# Altium project UZ_D_Incr_Encoder.PrjPCB
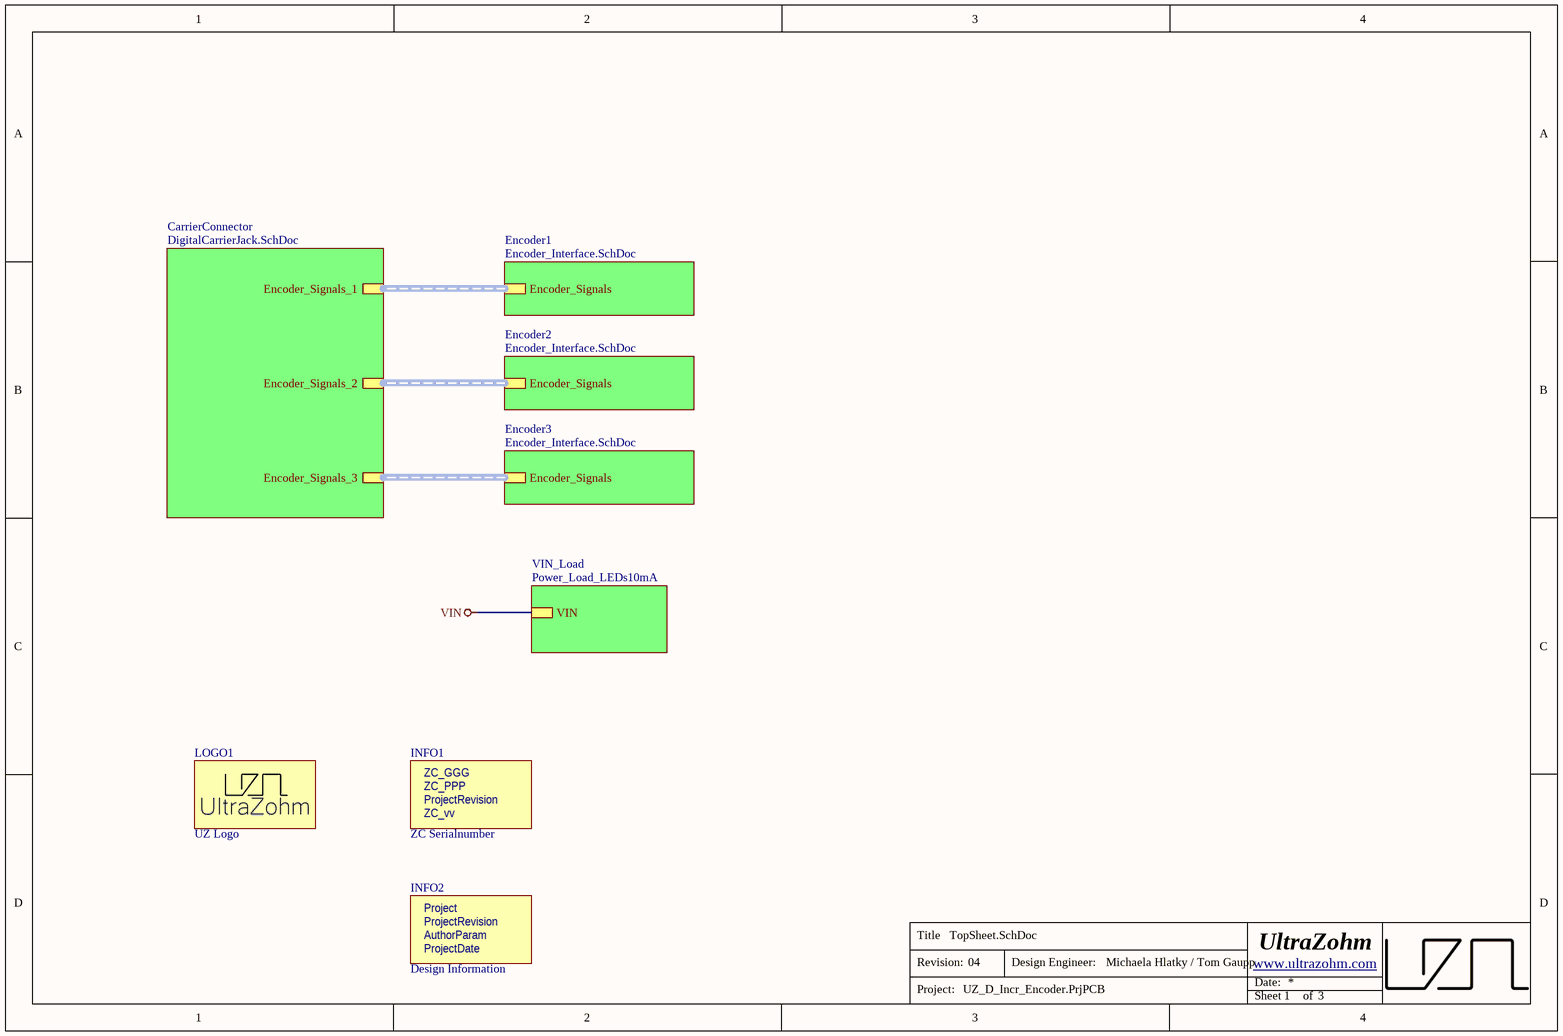
[diagram p0: TopSheet.SchDoc]
Author: Michaela Hlatky / Tom Gaupp; AuthorParam: Michaela Hlatky / Tom Gaupp; Date: 06/2022; Project: uz_d_incr_encoder; ProjectDate: 06/26; ProjectNameCustom: UZ_D_Incr_Encoder; ProjectRevision: 04; ZC_GGG: 000; ZC_PPP: 006; ZC_vv: 00
3 sheets, 101 parts. Net scope: hierarchical (ports join the sheet entries above them; power ports are global).
Board file: UZ_D_Incr_Encoder.PcbDoc
Sheets:
  TopSheet.SchDoc
    Encoder2 = Encoder_Interface.SchDoc
    Encoder3 = Encoder_Interface.SchDoc
    Encoder1 = Encoder_Interface.SchDoc
    CarrierConnector = DigitalCarrierJack.SchDoc

## Sheet TopSheet.SchDoc
size A4; Author: Michaela Hlatky / Tom Gaupp; CompanyName: Technische Hochschule Nürnberg Georg Simon Ohm; Organization: UltraZohm; Address1: Kesslerplatz 12; Address2: 90489 Nürnberg; Address3: GERMANY; DocumentNumber: 1; SheetNumber: 1; SheetTotal: 3; Website: www.ultrazohm.com

### Parts
INFO1  ZC Serialnumber  [ZC-Serial]  (no BOM)
INFO2  Design Information  [Design_info]  (no BOM)
LOGO1  UZ Logo  [UZ_Logo_small]  (no BOM)

### Sub-sheets
CarrierConnector = DigitalCarrierJack.SchDoc: Encoder_Signals_2 (harness Encoder_Signals), Encoder_Signals_1 (harness Encoder_Signals), Encoder_Signals_3 (harness Encoder_Signals)
Encoder1 = Encoder_Interface.SchDoc: Encoder_Signals (harness Encoder_Signals)
Encoder2 = Encoder_Interface.SchDoc: Encoder_Signals (harness Encoder_Signals)
Encoder3 = Encoder_Interface.SchDoc: Encoder_Signals (harness Encoder_Signals)
VIN_Load = Power_Load_LEDs10mA (file not in this document): VIN

### Buses and harness runs
harness sheet CarrierConnector/Encoder_Signals_1 = sheet Encoder1/Encoder_Signals
harness sheet CarrierConnector/Encoder_Signals_2 = sheet Encoder2/Encoder_Signals
harness sheet CarrierConnector/Encoder_Signals_3 = sheet Encoder3/Encoder_Signals

### Notes on the sheet
- Title
- Revision:
- Design Engineer:
- Date:
- Project:
- Sheet
- of
- (in symbol Design Information) Project; ProjectRevision; AuthorParam; ProjectDate
- (in symbol ZC-Serial) ZC_GGG; ZC_PPP; ProjectRevision; ZC_vv

### Library data of the parts
INFO1 = ZC-Serial: Manufacturer: UltraZohm; Value: GGG-PPP-VVvv; Created from: FRosner; Manufacturer Part Number: ZC-Serial; PartID: 58; Created On: 15/04/2025 09:17:14; ComponentLink1Description: https://docs.ultrazohm.com/; ComponentLink1URL: homepage; Component Type: ZC Serialnumber; Last Updated: 15/04/2025 09:17:14; Supplier 1: -; Supplier Part Number 1: -; Type: Serial Number; Live Cycle Status: 1
INFO2 = Design Information: Manufacturer: UltraZohm; Created from: MGremer; Manufacturer Part Number: Design Information; PartID: 12; Created On: 03/11/2021 09:04:23; ComponentLink1Description: https://docs.ultrazohm.com/; ComponentLink1URL: homepage; Component Type: Design Information; Last Updated: 15/04/2025 09:29:36; Supplier 1: -; Supplier Part Number 1: -; Type: Design Information; Value: Design Information; Live Cycle Status: 1
LOGO1 = Logo small: Manufacturer: UltraZohm; Created from: MGremer; Created: Jan2021_Liegmann; Value: Logo; Manufacturer Part Number: Logo small; PartID: 10; Created On: 03.11.2021 09:04:23; ComponentLink1Description: https://docs.ultrazohm.com/; ComponentLink1URL: homepage; Component Type: Logo; Last Updated: 03.11.2021 09:05:50; Supplier 1: -; Supplier Part Number 1: -; Type: Logo; Live Cycle Status: 1

## Sheet Encoder_Interface.SchDoc
size A4; Author: Michaela Hlatky / Tom Gaupp; CompanyName: Technische Hochschule Nürnberg Georg Simon Ohm; Organization: UltraZohm; Address1: Kesslerplatz 12; Address2: 90489 Nürnberg; Address3: GERMANY; DocumentNumber: 3; SheetNumber: 3; SheetTotal: 3; Website: www.ultrazohm.com
Used 3 times, as channels Encoder2, Encoder3, Encoder1. Parts and nets are listed once, with the designators drawn on the sheet.
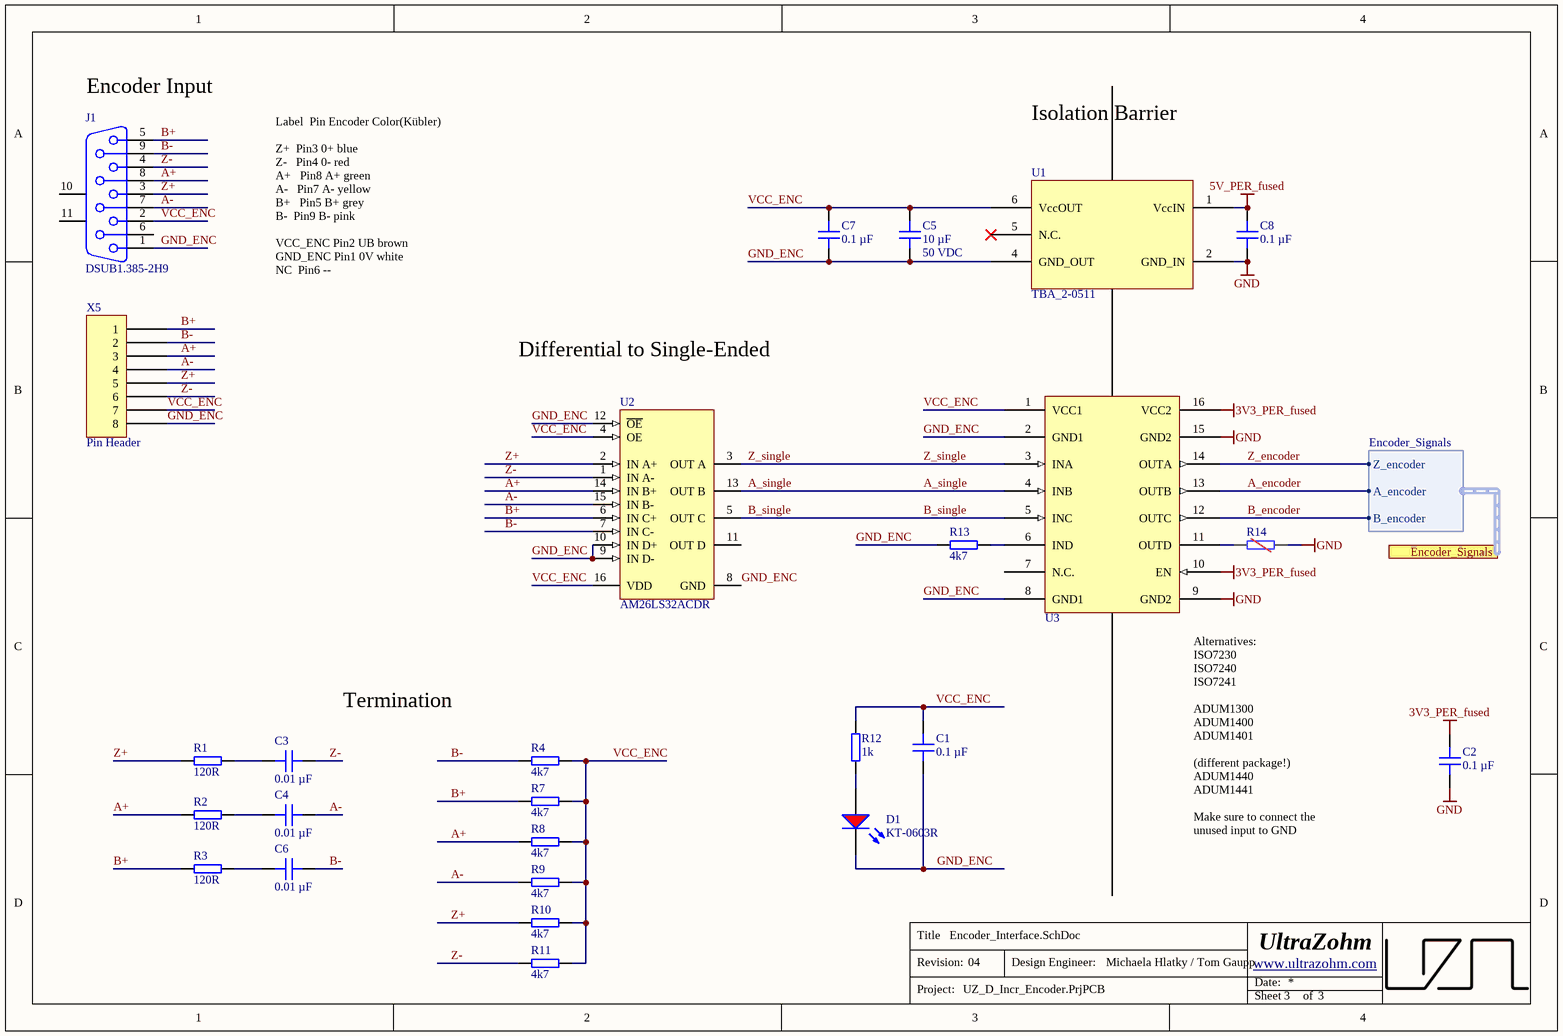
[diagram p1: Encoder_Interface.SchDoc]

### Parts
C1  0.1 µF  [C_0805]
C2  0.1 µF  [C_0805]
C3  0.01 µF  [C_0805]
C4  0.01 µF  [C_0805]
C5  10 µF  Voltage Rating: 50 VDC  [C_1206]
C6  0.01 µF  [C_0805]
C7  0.1 µF  [C_0805]
C8  0.1 µF  [C_0805]
D1  KT-0603R  [WL-SMCW_0603]
J1  DSUB1.385-2H9  [DSUB1.385-2H9]
R1  120R  [RES 0603_1608]
R2  120R  [RES 0603_1608]
R3  120R  [RES 0603_1608]
R4  4k7  [RES 0603_1608]
R7  4k7  [RES 0603_1608]
R8  4k7  [RES 0603_1608]
R9  4k7  [RES 0603_1608]
R10  4k7  [RES 0603_1608]
R11  4k7  [RES 0603_1608]
R12  1k  [RES 0603_1608]
R13  4k7  [RES 0603_1608]
R14  DNP  [R_0603_TE-DNP]  (value not drawn)  (no BOM)
U1  TBA_2-0511  [SIP7]
U2  AM26LS32ACDR  [D0016A_M]
U3  ISO7240MDWR  [SOIC-16]  (value not drawn)
X5  Pin Header  [HDR1X8]

### Ports
Encoder_Signals (harness Encoder_Signals)

### Harnesses
Encoder_Signals: A_encoder, B_encoder, Z_encoder

### Nets
3V3_PER_fused: C2.2 U3.10(EN) U3.16(VCC2)
5V_PER_fused: C8.2 U1.1(VccIN)
GND: C2.1 C8.1 R14.2 U1.2(GND_IN) U3.9(GND2) U3.15(GND2)
A+: J1.8 R2.1 R8.1 U2.14(IN_B+) X5.3
A-: C4.2 J1.7 R9.1 U2.15(IN_B-) X5.4
A_encoder: U3.13(OUTB) ; port Encoder_Signals.A_encoder
A_single: U2.13(OUT_B) U3.4(INB)
B+: J1.5 R3.1 R7.1 U2.6(IN_C+) X5.1
B-: C6.2 J1.9 R4.1 U2.7(IN_C-) X5.2
B_encoder: U3.12(OUTC) ; port Encoder_Signals.B_encoder
B_single: U2.5(OUT_C) U3.5(INC)
GND_ENC: C1.1 C5.1 C7.1 D1.1(K) J1.1 R13.1 U1.4(GND_OUT) U2.8(GND) U2.9(IN_D-) U2.10(IN_D+) U2.12(~{OE}) U3.2(GND1) U3.8(GND1) X5.8
VCC_ENC: C1.2 C5.2 C7.2 J1.2 R4.2 R7.2 R8.2 R9.2 R10.2 R11.2 R12.2 U1.6(VccOUT) U2.4(OE) U2.16(VDD) U3.1(VCC1) X5.7
Z+: J1.3 R1.1 R10.1 U2.2(IN_A+) X5.5
Z-: C3.2 J1.4 R11.1 U2.1(IN_A-) X5.6
Z_encoder: U3.14(OUTA) ; port Encoder_Signals.Z_encoder
Z_single: U2.3(OUT_A) U3.3(INA)
NetC3_1: C3.1 R1.2
NetC4_1: C4.1 R2.2
NetC6_1: C6.1 R3.2
NetD1_2: D1.2(A) R12.1
NetR13_2: R13.2 U3.6(IND)
NetR14_1: R14.1 U3.11(OUTD)

Not connected (* = marked no-connect by the designer): J1 6 10(MH1) 11(MH2); U1 5(N.C.)*; U2 11(OUT_D); U3 7(N.C.)

### Channels
Encoder2: designators C1=C1_2 C2=C2_2 C3=C3_2 C4=C4_2 C5=C5_2 C6=C6_2 C7=C7_2 C8=C8_2 D1=D1_2 J1=J1_2 R1=R1_2 R2=R2_2 R3=R3_2 R4=R4_2 R7=R7_2 R8=R8_2 R9=R9_2 R10=R10_2 R11=R11_2 R12=R12_2 R13=R13_2 R14=R14_1 U1=U1_1 U2=U2_2 U3=U3_1 X5=X5_2
Encoder3: designators C1=C1_3 C2=C2_3 C3=C3_3 C4=C4_3 C5=C5_3 C6=C6_3 C7=C7_3 C8=C8_3 D1=D1_3 J1=J1_3 R1=R1_3 R2=R2_3 R3=R3_3 R4=R4_3 R7=R7_3 R8=R8_3 R9=R9_3 R10=R10_3 R11=R11_3 R12=R12_3 R13=R13_3 R14=R14_2 U1=U1_2 U2=U2_3 U3=U3_2 X5=X5_3
Encoder1: designators C1=C1_1 C2=C2_1 C3=C3_1 C4=C4_1 C5=C5_1 C6=C6_1 C7=C7_1 C8=C8_1 D1=D1_1 J1=J1_1 R1=R1_1 R2=R2_1 R3=R3_1 R4=R4_1 R7=R7_1 R8=R8_1 R9=R9_1 R10=R10_1 R11=R11_1 R12=R12_1 R13=R13_1 R14=R14_3 U1=U1_3 U2=U2_1 U3=U3_3 X5=X5_1

### Notes on the sheet
- (near J1) Encoder Input
- Isolation Barrier
- Label		Pin	Encoder	Color(Kübler)
  Z+		Pin3	0+	blue
  Z- 		Pin4	0-	red
  A+ 		Pin8	A+	green
  A- 		Pin7	A-	yellow
  B+ 		Pin5	B+	grey
  B-		Pin9	B-	pink
  VCC_ENC	Pin2	UB	brown
  GND_ENC	Pin1	0V	white
  NC		Pin6	--
- Differential to Single-Ended
- Termination
- (near U3) Alternatives:
  ISO7230
  ISO7240
  ISO7241
  ADUM1300
  ADUM1400
  ADUM1401
  (different package!)
  ADUM1440
  ADUM1441
  Make sure to connect the unused input to GND
- Title
- Revision:
- Design Engineer:
- Date:
- Project:
- Sheet
- of

### Library data of the parts
C1 C2 C7 C8 = C0805C104J5RECTU: Capacitor 0805, 50 VDC, 0.1 µF, X7R; Manufacturer: KEMET; Tolerance: 5 %; Voltage Rating: 50 VDC; Created from: MGremer; Manufacturer Part Number: C0805C104J5RECTU; PartID: 17; Created On: 20.12.2020 13:54:13; ComponentLink1Description: Datasheet; ComponentLink1URL: https://www.mouser.de/datasheet/2/212/KEM_C1002_X7R_SMD-1102033.pdf; Component Type: Capacitor 0805; Device Package: 0805; Last Updated: 27.05.2022 20:15:41; Mounting Type: SMD; Operating Temperature: -55 - 125°C; Series: SMD Comm X7R; Supplier 1: Mouser; Supplier Part Number 1: 80-C0805C104J5RECTU; Type: Capacitor; Value: 0.1 µF; Live Cycle Status: 1; Stock number: Labor SMD Container; LCSC Part Number: C49678
C3 C4 C6 = C0805X103K5RAC3316: Capacitor 0805, 50 VDC, 0.01 µF, X7R; Manufacturer: KEMET; Tolerance: 10 %; Voltage Rating: 50 VDC; Created from: MGremer; Manufacturer Part Number: C0805X103K5RAC3316; PartID: 21; Created On: 20.12.2020 13:54:13; ComponentLink1Description: Datasheet; ComponentLink1URL: https://www.mouser.de/datasheet/2/212/KEM_X7R_FT_VW_AUDI-1775098.pdf; Component Type: Capacitor 0805; Device Package: 0805; Last Updated: 27.05.2022 20:11:47; Mounting Type: SMD; Operating Temperature: -55 - 125°C; Series: SMD Comm X7R; Supplier 1: Mouser; Supplier Part Number 1: 80-C0805X103K5RC3316; Type: Capacitor; Value: 0.01 µF; Live Cycle Status: 1; Stock number: Labor SMD Container; LCSC Part Number: C1710
C5 = CGA5L1X7R1H106K160AC: Capacitor 1206, 50 VDC, 10 µF, X7R; Manufacturer: TDK; Tolerance: 10 %; Created from: MGremer; Manufacturer Part Number: CGA5L1X7R1H106K160AC; PartID: 25; Created On: 20.12.2020 13:54:13; ComponentLink1Description: Datasheet; ComponentLink1URL: https://product.tdk.com/info/en/catalog/datasheets/mlcc_automotive_general_en.pdf; Component Type: Capacitor 1206; Device Package: 1206; Last Updated: 27.05.2022 14:15:21; Mounting Type: SMD; Operating Temperature: -55 - 125°C; Series: CGA; Supplier 1: Mouser; Supplier Part Number 1: 810-CGA5L1X7R1H106K1; Type: Capacitor; Value: 10 µF; Live Cycle Status: 1; LCSC Part Number: C13585; Stock number: Labor SMD Container
D1 = KT-0603R: LED RED 520~625NM 90~100MCD@20MA TOP VIEW 0603 ROHS; Manufacturer: Hubei KENTO Elec; Type: Standard; Created from: T. Wendt; Forward Current I_f: 20 mA; Forward Voltage U_f: 2.1 V; Wavelength: 620 nm; Light Intensity: 110 mcd; Nominal Power: 42 mW; Manufacturer Part Number: KT-0603R; PartID: 8; Created On: 03.03.2021 10:06:23; ComponentLink1Description: Datasheet; ComponentLink1URL: https://datasheet.lcsc.com/szlcsc/Hubei-KENTO-Elec-KT-0603R_C2286.pdf; Component Type: LED Diode; Device Package: 0603; Last Updated: 04.03.2021 09:02:49; Mounting Type: SMD; Operating Temperature: -40 - 85 °C; Supplier 1: LCSC; Supplier Part Number 1: C2286; Live Cycle Status: 1; Stock number: not stored; Color: red; LCSC Part Number: C2286
J1 = DSUB1.385-2H9: Connector; D Subminiature; 9 Position; Right Angle; Pitch 1.385 mm; Manufacturer: TE Connectivity; PackageDocument: O; Positions: 9; Gender: Receptacle; Created from: MHlatky; Published: 15-Jun-2001; LatestRevisionDate: 17-Jul-2002; LatestRevisionNote: Re-released for DXP Platform.; DatasheetDocument: 1-Sep-1999; PackageReference: 788750; Publisher: Altium Limited; Orientation: Right Angle; Manufacturer Part Number: DSUB1.385-2H9; PartID: 5; Created On: 26.01.2021 09:19:51; ComponentLink1Description: Datasheet; ComponentLink1URL: https://www.mouser.de/datasheet/2/418/7/ENG_CD_2311765_D-2072985.pdf; Component Type: DSUB Connector; Device Package: -; Last Updated: 27.05.2022 15:54:50; Type: DSUB Connector; Live Cycle Status: 1; Stock number: not stored; Supplier 1: Mouser; Supplier Part Number 1: 571-2311765-1; LCSC Part Number: C141882
R1-R3 = RK73B1JTTD121J: SMD resistor E24 series; Manufacturer: KOA Speer; Tolerance: 5%; Created from: MGremer; Manufacturer Part Number: RK73B1JTTD121J; PartID: 52; Created On: 14.12.2020 16:17:14; ComponentLink1Description: Datasheet; ComponentLink1URL: https://www.mouser.de/datasheet/2/219/RK73B-1825463.pdf; Component Type: SMD resistor; Device Package: 0603; Last Updated: 27.05.2022 13:40:47; Mounting Type: SMD; Supplier 1: Mouser; Supplier Part Number 1: 660-RK73B1JTTD121J; Type: Resistor; Value: 120R; Live Cycle Status: 1; Stock number: Labor SMD Container; LCSC Part Number: C22787
R4 R7-R11 R13 = RK73B1JTTD472J: SMD resistor E24 series; Manufacturer: KOA Speer; Tolerance: 5%; Created from: MGremer; Manufacturer Part Number: RK73B1JTTD472J; PartID: 90; Created On: 14.12.2020 16:17:14; ComponentLink1Description: Datasheet; ComponentLink1URL: https://www.mouser.de/datasheet/2/219/RK73B-1825463.pdf; Component Type: SMD resistor; Device Package: 0603; Last Updated: 27.05.2022 13:46:16; Mounting Type: SMD; Supplier 1: Mouser; Supplier Part Number 1: 660-RK73B1JTTD472J; Type: Resistor; Value: 4k7; Live Cycle Status: 1; Stock number: Labor SMD Container; LCSC Part Number: C23162
R12 = RK73B1JTTDD102J: SMD resistor E24 series; Manufacturer: KOA Speer; Tolerance: 5%; Created from: MGremer; Manufacturer Part Number: RK73B1JTTDD102J; PartID: 74; Created On: 14.12.2020 16:17:14; ComponentLink1Description: Datasheet; ComponentLink1URL: https://www.mouser.de/datasheet/2/219/RK73B-1825463.pdf; Component Type: SMD resistor; Device Package: 0603; Last Updated: 27.05.2022 13:40:21; Mounting Type: SMD; Supplier 1: Mouser; Supplier Part Number 1: 660-RK73B1JTTDD102J; Type: Resistor; Value: 1k; Live Cycle Status: 1; Stock number: Labor SMD Container; LCSC Part Number: C21190
R14 = UZgen_R_0603_DNP: Generic resistor (DNP); Manufacturer: UZgen; Created from: UZgenTool; Manufacturer Part Number: UZgen_R_0603_DNP; PartID: 593; Created On: 25/03/2025 14:26:15; Value: DNP; Device Package: 0603; Tolerance: -; Mounting Type: SMD; Last Updated: 02/04/2025 19:05:00
U1 = TBA_2-0511: 4.5-5.5 V Input, 5 V @ 400 mA Output, 2 W, isolated DC/DC-converter; Manufacturer: TRACO Power; Created from: TGaupp; Manufacturer Part Number: TBA_2-0511; PartID: 25; Created On: 28/04/2026 12:30:53; ComponentLink1Description: Datasheet; ComponentLink1URL: https://www.tracopower.com/tba2-datasheet; Component Type: Isolated DC/DC; Device Package: 19.55mm x 7.6 mm x 10.2 mm; Last Updated: 28/04/2026 12:43:25; Mounting Type: THT; Operating Temperature: -40 - 80 °C; Supplier 1: LCSC; Supplier Part Number 1: C6329167; Type: Isolated DC/DC; Live Cycle Status: 1; LCSC Part Number: C6329167; Stock number: not stored
U2 = AM26LS32ACDR: AM26LS32Ax, AM26LS33Ax Quadruple Differential Line Receivers; PartNumber: DS26LS32ACM; Manufacturer: Texas Instruments; PackageTopMarking: NSUZXYTTE#*DS26LS32*ACM; PowerWise: N; CompType: Interface IC; Created from: MHlatky; Published: 4-Dec-2008; DatasheetVersion: May-1999; PackageVersion: revJ, Aug-1995; PackageReference: M16A; Publisher: Altium Limited; PackageDescription: Molded Package, SO, .150in Wide, 16 Lead; Supplier 1: Mouser; Supplier Part Number 1: 595-AM26LS32ACDR; RoHS: N; PinCount: 16; Code_JEDEC: MS-012-AC; Code_IPC: SOIC127P600-16; ComponentLink1Description: Datasheet; ComponentLink1URL: https://www.ti.com/lit/ds/symlink/am26ls32ac.pdf; ComponentLink2Description: DS26LS32AC Web Page; ComponentLink2URL: http://www.national.com/pf/DS/DS26LS32AC.html; ComponentLink3Description: M16A Package Page; ComponentLink3URL: http://www.national.com/packaging/folders/m16a.html; Manufacturer Part Number: AM26LS32ACDR; PartID: 14; Created On: 26.01.2021 09:03:43; Component Type: Quad Diff. Receiver; Last Updated: 27.05.2022 17:40:36; Mounting Type: SMT; Operating Temperature: 0 - 70 °C; Type: Diff Line Receivers; Live Cycle Status: 1; Stock number: not stored; LCSC Part Number: C6180
U3 = ISO7240MDWR: ISO7240x Quad Ch 4  150Mbps Digital Isolator; Manufacturer: Texas Instruments; Created from: TGaupp; Manufacturer Part Number: ISO7240MDWR; PartID: 18; Created On: 06/05/2026 09:53:28; ComponentLink1Description: Datasheet; ComponentLink1URL: https://www.ti.com/lit/ds/symlink/iso7240m.pdf?ts=1777988403849&ref_url=https%253A%252F%252Fwww.mouser.de%252F; Component Type: Digital Isolator; Device Package: SOIC-16; Last Updated: 06/05/2026 10:10:35; Mounting Type: SMD; Operating Temperature: -40 to +125 °C; Series: ISO7240; Supplier 1: Mouser; Supplier Part Number 1: 595-ISO7240MDWR; Supplier 2: LCSC; Supplier Part Number 2: C37709; Type: Digital Isolator; Value: ISO7240MDWR; LCSC Part Number: C37709
X5 = 103741-8: 8 Pin; Manufacturer: TE Connectivity; Created from: MHlatky; Manufacturer Part Number: 103741-8; PartID: 9; Created On: 22.11.2021 15:31:45; ComponentLink1Description: Datasheet; ComponentLink1URL: https://www.mouser.de/datasheet/2/427/VISH_S_A0003529023_1-2568887.pdf; Component Type: Pin Header; Last Updated: 21.03.2022 12:19:22; Supplier 1: Mouser; Supplier Part Number 1: 571-103741-8; Type: Pin Header; Live Cycle Status: 1; Stock number: not stored

## Sheet DigitalCarrierJack.SchDoc
size A4; Author: Michaela Hlatky / Tom Gaupp; CompanyName: Technische Hochschule Nürnberg Georg Simon Ohm; Organization: UltraZohm; Address1: Kesslerplatz 12; Address2: 90489 Nürnberg; Address3: GERMANY; DocumentNumber: 2; SheetNumber: 2; SheetTotal: 3; Website: www.ultrazohm.com
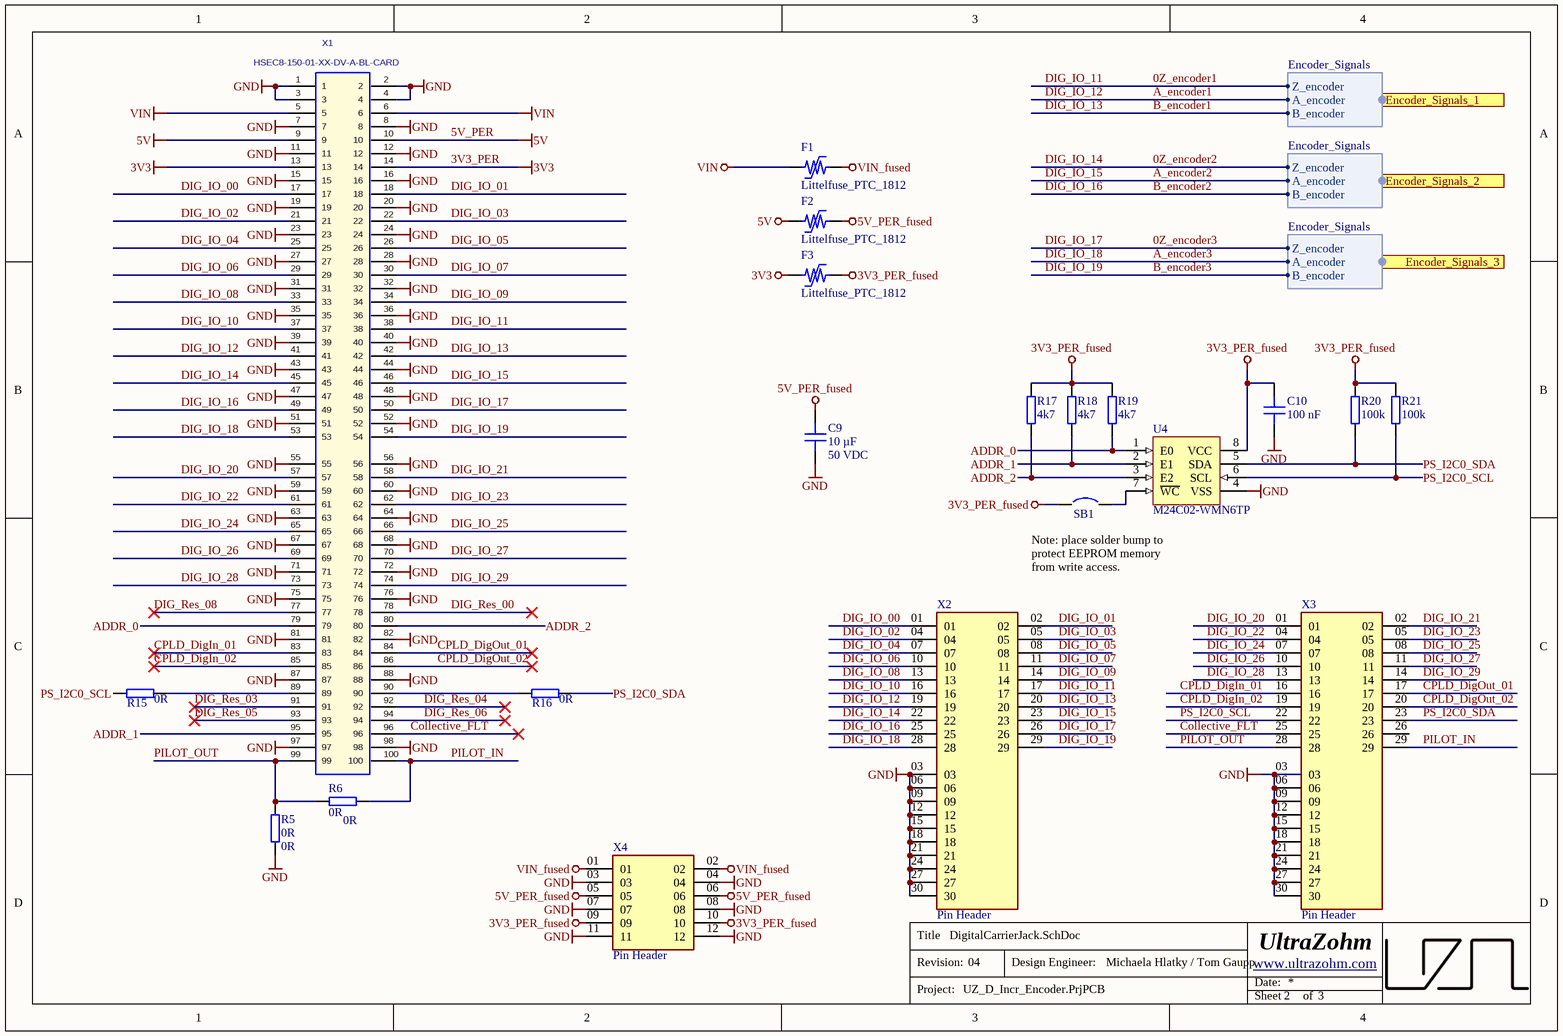
[diagram p2: DigitalCarrierJack.SchDoc]

### Parts
C9  10 µF  Voltage Rating: 50 VDC  [C_1206]
C10  100 nF  [C_0603]
F1  Littelfuse_PTC_1812  [1812_PTC_Polyfuse_Littelfuse]
F2  Littelfuse_PTC_1812  [1812_PTC_Polyfuse_Littelfuse]
F3  Littelfuse_PTC_1812  [1812_PTC_Polyfuse_Littelfuse]
R5  0R  [RES 0603_1608]
R6  0R  [RES 0603_1608]
R15  0R  [RES 0603_1608]
R16  0R  [RES 0603_1608]
R17  4k7  [RES 0603_1608]
R18  4k7  [RES 0603_1608]
R19  4k7  [RES 0603_1608]
R20  100k  [RES 0603_1608]
R21  100k  [RES 0603_1608]
SB1  (no value)  [SB_0603]  (no BOM)
U4  M24C02-WMN6TP  [D0008A_N]
X1  HSEC8-150-01-XX-DV-A-BL-CARD  [HSEC8-150-01-XX-DV-A-BL-CARD]  (no BOM)
X2  Pin Header  [SAMTEC_TSW-110-07-F-T]
X3  Pin Header  [SAMTEC_TSW-110-07-F-T]
X4  Pin Header  [SAMTEC_TSW-106-07-F-D]

### Ports
Encoder_Signals_1 (harness Encoder_Signals), Encoder_Signals_2 (harness Encoder_Signals), Encoder_Signals_3 (harness Encoder_Signals)

### Harnesses
Encoder_Signals: A_encoder, B_encoder, Z_encoder

### Nets
3V3_PER: F3.1 X1.13 X1.14  [also labelled 3V3]
3V3_PER_fused: C10.2 F3.2 R17.2 R18.2 R19.2 R20.2 R21.2 SB1.1 U4.8(VCC) X4.09 X4.10
5V_PER: F2.1 X1.9 X1.10  [also labelled 5V]
5V_PER_fused: C9.2 F2.2 X4.05 X4.06
GND: C9.1 C10.1 R5.1 U4.4(VSS) X1.1 X1.2 X1.3 X1.4 X1.7 X1.8 X1.11 X1.12 X1.15 X1.16 X1.19 X1.20 X1.23 X1.24 X1.27 X1.28 X1.31 X1.32 X1.35 X1.36 X1.39 X1.40 X1.43 X1.44 X1.47 X1.48 X1.51 X1.52 X1.55 X1.56 X1.59 X1.60 X1.63 X1.64 X1.67 X1.68 X1.71 X1.72 X1.75 X1.76 X1.81 X1.82 X1.87 X1.88 X1.97 X1.98 X2.03 X2.06 X2.09 X2.12 X2.15 X2.18 X2.21 X2.24 X2.27 X2.30 X3.03 X3.06 X3.09 X3.12 X3.15 X3.18 X3.21 X3.24 X3.27 X3.30 X4.03 X4.04 X4.07 X4.08 X4.11 X4.12
VIN: F1.1 X1.5 X1.6
VIN_fused: F1.2 X4.01 X4.02
0Z_encoder1: X1.38 X2.17 ; port Encoder_Signals_1.Z_encoder  [also labelled DIG_IO_11]
0Z_encoder2: X1.45 X2.22 ; port Encoder_Signals_2.Z_encoder  [also labelled DIG_IO_14]
0Z_encoder3: X1.50 X2.26 ; port Encoder_Signals_3.Z_encoder  [also labelled DIG_IO_17]
A_encoder1: X1.41 X2.19 ; port Encoder_Signals_1.A_encoder  [also labelled DIG_IO_12]  [project net A_encoder]
A_encoder2: X1.46 X2.23 ; port Encoder_Signals_2.A_encoder  [also labelled DIG_IO_15]  [project net A_encoder]
A_encoder3: X1.53 X2.28 ; port Encoder_Signals_3.A_encoder  [also labelled DIG_IO_18]  [project net A_encoder]
ADDR_0: R19.1 U4.1(E0) X1.79
ADDR_1: R18.1 U4.2(E1) X1.95
ADDR_2: R17.1 U4.3(E2) X1.80
B_encoder1: X1.42 X2.20 ; port Encoder_Signals_1.B_encoder  [also labelled DIG_IO_13]  [project net B_encoder]
B_encoder2: X1.49 X2.25 ; port Encoder_Signals_2.B_encoder  [also labelled DIG_IO_16]  [project net B_encoder]
B_encoder3: X1.54 X2.29 ; port Encoder_Signals_3.B_encoder  [also labelled DIG_IO_19]  [project net B_encoder]
Collective_FLT: X1.96 X3.25
CPLD_DigIn_01: X1.83 X3.16
CPLD_DigIn_02: X1.85 X3.19
CPLD_DigOut_01: X1.84 X3.17
CPLD_DigOut_02: X1.86 X3.20
DIG_IO_00: X1.17 X2.01
DIG_IO_01: X1.18 X2.02
DIG_IO_02: X1.21 X2.04
DIG_IO_03: X1.22 X2.05
DIG_IO_04: X1.25 X2.07
DIG_IO_05: X1.26 X2.08
DIG_IO_06: X1.29 X2.10
DIG_IO_07: X1.30 X2.11
DIG_IO_08: X1.33 X2.13
DIG_IO_09: X1.34 X2.14
DIG_IO_10: X1.37 X2.16
DIG_IO_20: X1.57 X3.01
DIG_IO_21: X1.58 X3.02
DIG_IO_22: X1.61 X3.04
DIG_IO_23: X1.62 X3.05
DIG_IO_24: X1.65 X3.07
DIG_IO_25: X1.66 X3.08
DIG_IO_26: X1.69 X3.10
DIG_IO_27: X1.70 X3.11
DIG_IO_28: X1.73 X3.13
DIG_IO_29: X1.74 X3.14
DIG_Res_00: X1.78
DIG_Res_03: X1.91
DIG_Res_04: X1.92
DIG_Res_05: X1.93
DIG_Res_06: X1.94
DIG_Res_08: X1.77
PILOT_IN: R6.2 X1.100 X3.29
PILOT_OUT: R5.2 R6.1 X1.99 X3.28
PS_I2C0_SCL: R15.1 R21.1 U4.6(SCL) X3.22
PS_I2C0_SDA: R16.2 R20.1 U4.5(SDA) X3.23
NetR15_2: R15.2 X1.89
NetR16_1: R16.1 X1.90
NetSB1_2: SB1.2 U4.7(~{WC})

Not connected (* = marked no-connect by the designer): X3 26

### Notes on the sheet
- Note: place solder bump to protect EEPROM memory from write access.
- Title
- Revision:
- Design Engineer:
- Date:
- Project:
- Sheet
- of

### Library data of the parts
C9 = CGA5L1X7R1H106K160AC: as C5 on sheet Encoder_Interface; Manufacturer Part Number: CGA5L1X7R1H106K160AC; PartID: 25; Created On: 20.12.2020 13:54:13; ComponentLink1Description: Datasheet; ComponentLink1URL: https://product.tdk.com/info/en/catalog/datasheets/mlcc_automotive_general_en.pdf; Component Type: Capacitor 1206; Device Package: 1206; Last Updated: 27.05.2022 14:15:21; Mounting Type: SMD; Operating Temperature: -55 - 125°C; Series: CGA; Supplier 1: Mouser; Supplier Part Number 1: 810-CGA5L1X7R1H106K1; Type: Capacitor; Value: 10 µF; Live Cycle Status: 1; LCSC Part Number: C13585; Stock number: Labor SMD Container
C10 = CC0603KRX7R9BB104: Capacitor 0603, 50 VDC, 100 nF, X7R; Manufacturer: YAGEO; Tolerance: 10 %; Voltage Rating: 50 VDC; Created from: AGeiger; Manufacturer Part Number: CC0603KRX7R9BB104; PartID: 102; Created On: 22/08/2022 14:35:53; ComponentLink1Description: Datasheet; ComponentLink1URL: https://datasheet.lcsc.com/lcsc/1809301912_YAGEO-CC0603KRX7R9BB104_C14663.pdf; Component Type: Capacitor 0603; Device Package: 0603; Last Updated: 22/08/2022 14:35:53; Mounting Type: SMD; Operating Temperature: -55 - 125°C; Series: X7R; Supplier 1: LCSC; Supplier Part Number 1: C14663; Supplier 2: Mouser; Supplier Part Number 2: 603-CC603KRX7R9BB104; Type: Capacitor; Value: 100 nF; Live Cycle Status: 1; LCSC Part Number: C14663
F1-F3 = Littelfuse_PTC_1812: POLYSWITCH RESETTABLE DEVICES; MPN: miniASMDC110F/24; Value: PTC, 1.1 A, 24V; Voltage: 24V; Trip Current: 2.2A; Hold Current: 1.1A; Resistance: 0.18 Ohm; Type: Fuse; Nominal current: 1 A; Created from: MHlatky; MF: Littelfuse; Created: 2019_02_10_AGeiger; Package: 1812; ComponentLink1URL: https://www.littelfuse.com/~/media/electronics/datasheets/resettable_ptcs/littelfuse_ptc_surface_mount_catalog_datasheet.pdf.pdf; ComponentLink1Description: Datasheet; Manufacturer Part Number: Littelfuse_PTC_1812; PartID: 5; Created On: 07.05.2021 06:50:33; Component Type: Littelfuse_PTC_1812; Last Updated: 27.05.2022 15:06:17; Manufacturer: Littelfuse; Mounting Type: SMD; Operating Temperature: -40 - 85 °C; Supplier 1: Mouser; Supplier Part Number 1: 530-0ZCG0150BF2C; Live Cycle Status: 1; LCSC Part Number: C70119
R5 R6 R15 R16 = RC0603JR-070RL: SMD resistor E24 series; Manufacturer: YAGEO; Tolerance: 5%; Created from: MGremer; Manufacturer Part Number: RC0603JR-070RL; PartID: 1; Created On: 14.12.2020 16:17:14; ComponentLink1Description: Datasheet; ComponentLink1URL: https://www.mouser.de/datasheet/2/447/PYu-RC_Group_51_RoHS_L_10-1664068.pdf; Component Type: SMD resistor; Device Package: 0603; Last Updated: 04.03.2021 09:09:42; Mounting Type: SMD; Supplier 1: Mouser; Supplier Part Number 1: 603-RC0603JR-070RL; Supplier 2: LCSC; Supplier Part Number 2: C21189; Type: Resistor; Value: 0R; Live Cycle Status: 1; Stock number: Labor SMD Container; LCSC Part Number: C21189
R17-R19 = RK73B1JTTD472J: as R4 on sheet Encoder_Interface; Manufacturer Part Number: RK73B1JTTD472J; PartID: 90; Created On: 14.12.2020 16:17:14; ComponentLink1Description: Datasheet; ComponentLink1URL: https://www.mouser.de/datasheet/2/219/RK73B-1825463.pdf; Component Type: SMD resistor; Device Package: 0603; Last Updated: 27.05.2022 13:46:16; Mounting Type: SMD; Supplier 1: Mouser; Supplier Part Number 1: 660-RK73B1JTTD472J; Type: Resistor; Value: 4k7; Live Cycle Status: 1; Stock number: Labor SMD Container; LCSC Part Number: C23162
R20 R21 = RK73B1JTTD104J: SMD resistor E24 series; Manufacturer: KOA Speer; Tolerance: 5%; Created from: MGremer; Manufacturer Part Number: RK73B1JTTD104J; PartID: 122; Created On: 14.12.2020 16:17:14; ComponentLink1Description: Datasheet; ComponentLink1URL: https://www.mouser.de/datasheet/2/219/RK73B-1825463.pdf; Component Type: SMD resistor; Device Package: 0603; Last Updated: 27.05.2022 14:04:10; Mounting Type: SMD; Supplier 1: Mouser; Supplier Part Number 1: 660-RK73B1JTTD104J; Type: Resistor; Value: 100k; Live Cycle Status: 1; Stock number: Labor SMD Container; LCSC Part Number: C25803
SB1 = Solder Bump 0603: Created from: AGeiger; Revision: July-2002: Re-released for DXP Platform.; Manufacturer Part Number: Solder Bump 0603; PartID: 1; Created On: 09/01/2024 17:13:56; Component Type: Solder Bump; Device Package: 0603; Last Updated: 02/10/2025 12:53:47; Mounting Type: SMD; Value: Solder Bump 0603
U4 = M24C02-WMN6TP: 2Kbit I2C SOP-8 EEPROM ROHS; Manufacturer: STMicroelectronics; Created from: AGeiger; Manufacturer Part Number: M24C02-WMN6TP; PartID: 1; Created On: 19.11.2023 14:54:27; ComponentLink1Description: Datasheet; ComponentLink1URL: https://www.st.com/resource/en/datasheet/m24c01-w.pdf; Component Type: EEPROM; Device Package: SOIC-8; Last Updated: 19.11.2023 21:39:04; Mounting Type: SMD; Operating Temperature: -40 to +85 °C; Series: M24xxx; Supplier 1: Mouser; Supplier Part Number 1: 511-M24C02-WMN6TP; Supplier 2: LCSC; Supplier Part Number 2: C7562; Type: Memory; Value: M24C02-WMN6TP; LCSC Part Number: C7562
X1 = HSEC8-150-01-XX-DV-A-BL-CARD: Mating Card Layout for HSEC8-150-01-XX-DV-A-BL; Manufacturer: SAMTEC; Created: 2018_04_23_AGeiger; Value: HSEC8-150-01-XX-DV-A-BL-CARD
X2 X3 = TSW-110-07-F-T: THROUGH-HOLE .025" SQ POST HEADER; Manufacturer: SAMTEC; MF: Samtec Inc.; Created from: MHlatky; Value: *; MP: TSW-110-07-F-T; Package: None; Price: None; Availability: Unavailable; Manufacturer Part Number: TSW-110-07-F-T; PartID: 7; Created On: 22.11.2021 15:31:45; ComponentLink1Description: Datasheet; ComponentLink1URL: https://www.mouser.de/datasheet/2/527/tsw_th-2854687.pdf; Component Type: Pin Header; Device Package: THT; Last Updated: 20.12.2021 07:38:08; Mounting Type: THT; Operating Temperature: -55 +125 °C; Series: TSW; Supplier 1: Mouser; Supplier Part Number 1: 200-TSW11007FT; Type: Pin Header; Live Cycle Status: 1; Stock number: not stored
X4 = TSW-106-07-F-D: THROUGH-HOLE .025" SQ POST HEADER; MF: Samtec; Created from: MHlatky; MP: TSW-106-07-F-D; Price: None; Package: None; Value: *; Availability: Unavailable; Manufacturer Part Number: TSW-106-07-F-D; PartID: 8; Created On: 22.11.2021 15:31:45; ComponentLink1Description: Datasheet; ComponentLink1URL: https://www.mouser.de/datasheet/2/527/tsw_th-2854687.pdf; Component Type: Pin Header; Device Package: THT; Last Updated: 20.12.2021 07:38:08; Manufacturer: SAMTEC; Mounting Type: THT; Operating Temperature: -55 +125 °C; Series: TSW; Supplier 1: Mouser; Supplier Part Number 1: 200-TSW10607FD; Type: Pin Header; Live Cycle Status: 1; Stock number: not stored

## Nets that join several sheets
3V3_PER_fused: Encoder2 (C2_2.2 U3_1.10 U3_1.16), Encoder3 (C2_3.2 U3_2.10 U3_2.16), Encoder1 (C2_1.2 U3_3.10 U3_3.16), DigitalCarrierJack (11 pins)
5V_PER_fused: Encoder2 (C8_2.2 U1_1.1), Encoder3 (C8_3.2 U1_2.1), Encoder1 (C8_1.2 U1_3.1), DigitalCarrierJack (C9.2 F2.2 X4.05 X4.06)
GND: Encoder2 (6 pins), Encoder3 (6 pins), Encoder1 (6 pins), DigitalCarrierJack (76 pins)
0Z_encoder1: Encoder1 (U3_3.14), DigitalCarrierJack (X1.38 X2.17)
0Z_encoder2: Encoder2 (U3_1.14), DigitalCarrierJack (X1.45 X2.22)
0Z_encoder3: Encoder3 (U3_2.14), DigitalCarrierJack (X1.50 X2.26)
A_encoder: Encoder2 (U3_1.13), DigitalCarrierJack (X1.46 X2.23)
A_encoder: Encoder3 (U3_2.13), DigitalCarrierJack (X1.53 X2.28)
A_encoder: Encoder1 (U3_3.13), DigitalCarrierJack (X1.41 X2.19)
B_encoder: Encoder2 (U3_1.12), DigitalCarrierJack (X1.49 X2.25)
B_encoder: Encoder3 (U3_2.12), DigitalCarrierJack (X1.54 X2.29)
B_encoder: Encoder1 (U3_3.12), DigitalCarrierJack (X1.42 X2.20)

## Assembly variants
Default: not fitted Cb1 Cb2 R5 R14_1 R14_2 R14_3 X2 X3 X4 X5_1 X5_2 X5_3; alternate parts Rb1 -> RC0603FR-07240RL, Rb2 -> RC0603FR-07240RL, Rb3 -> RC0603FR-07240RL, Rb4 -> RC0603FR-07240RL, Rb5 -> RC0603FR-07240RL, Rb6 -> RC0603FR-07240RL